# EasyEDA schematic N2 Avionics board.json

## Sheets
1 Sheet_1: TITLE: Avionics N2; REV: 1.0; Date: 2021-09-09; Sheet: 1/1; Drawn By: mike99; Company: Nakuja project
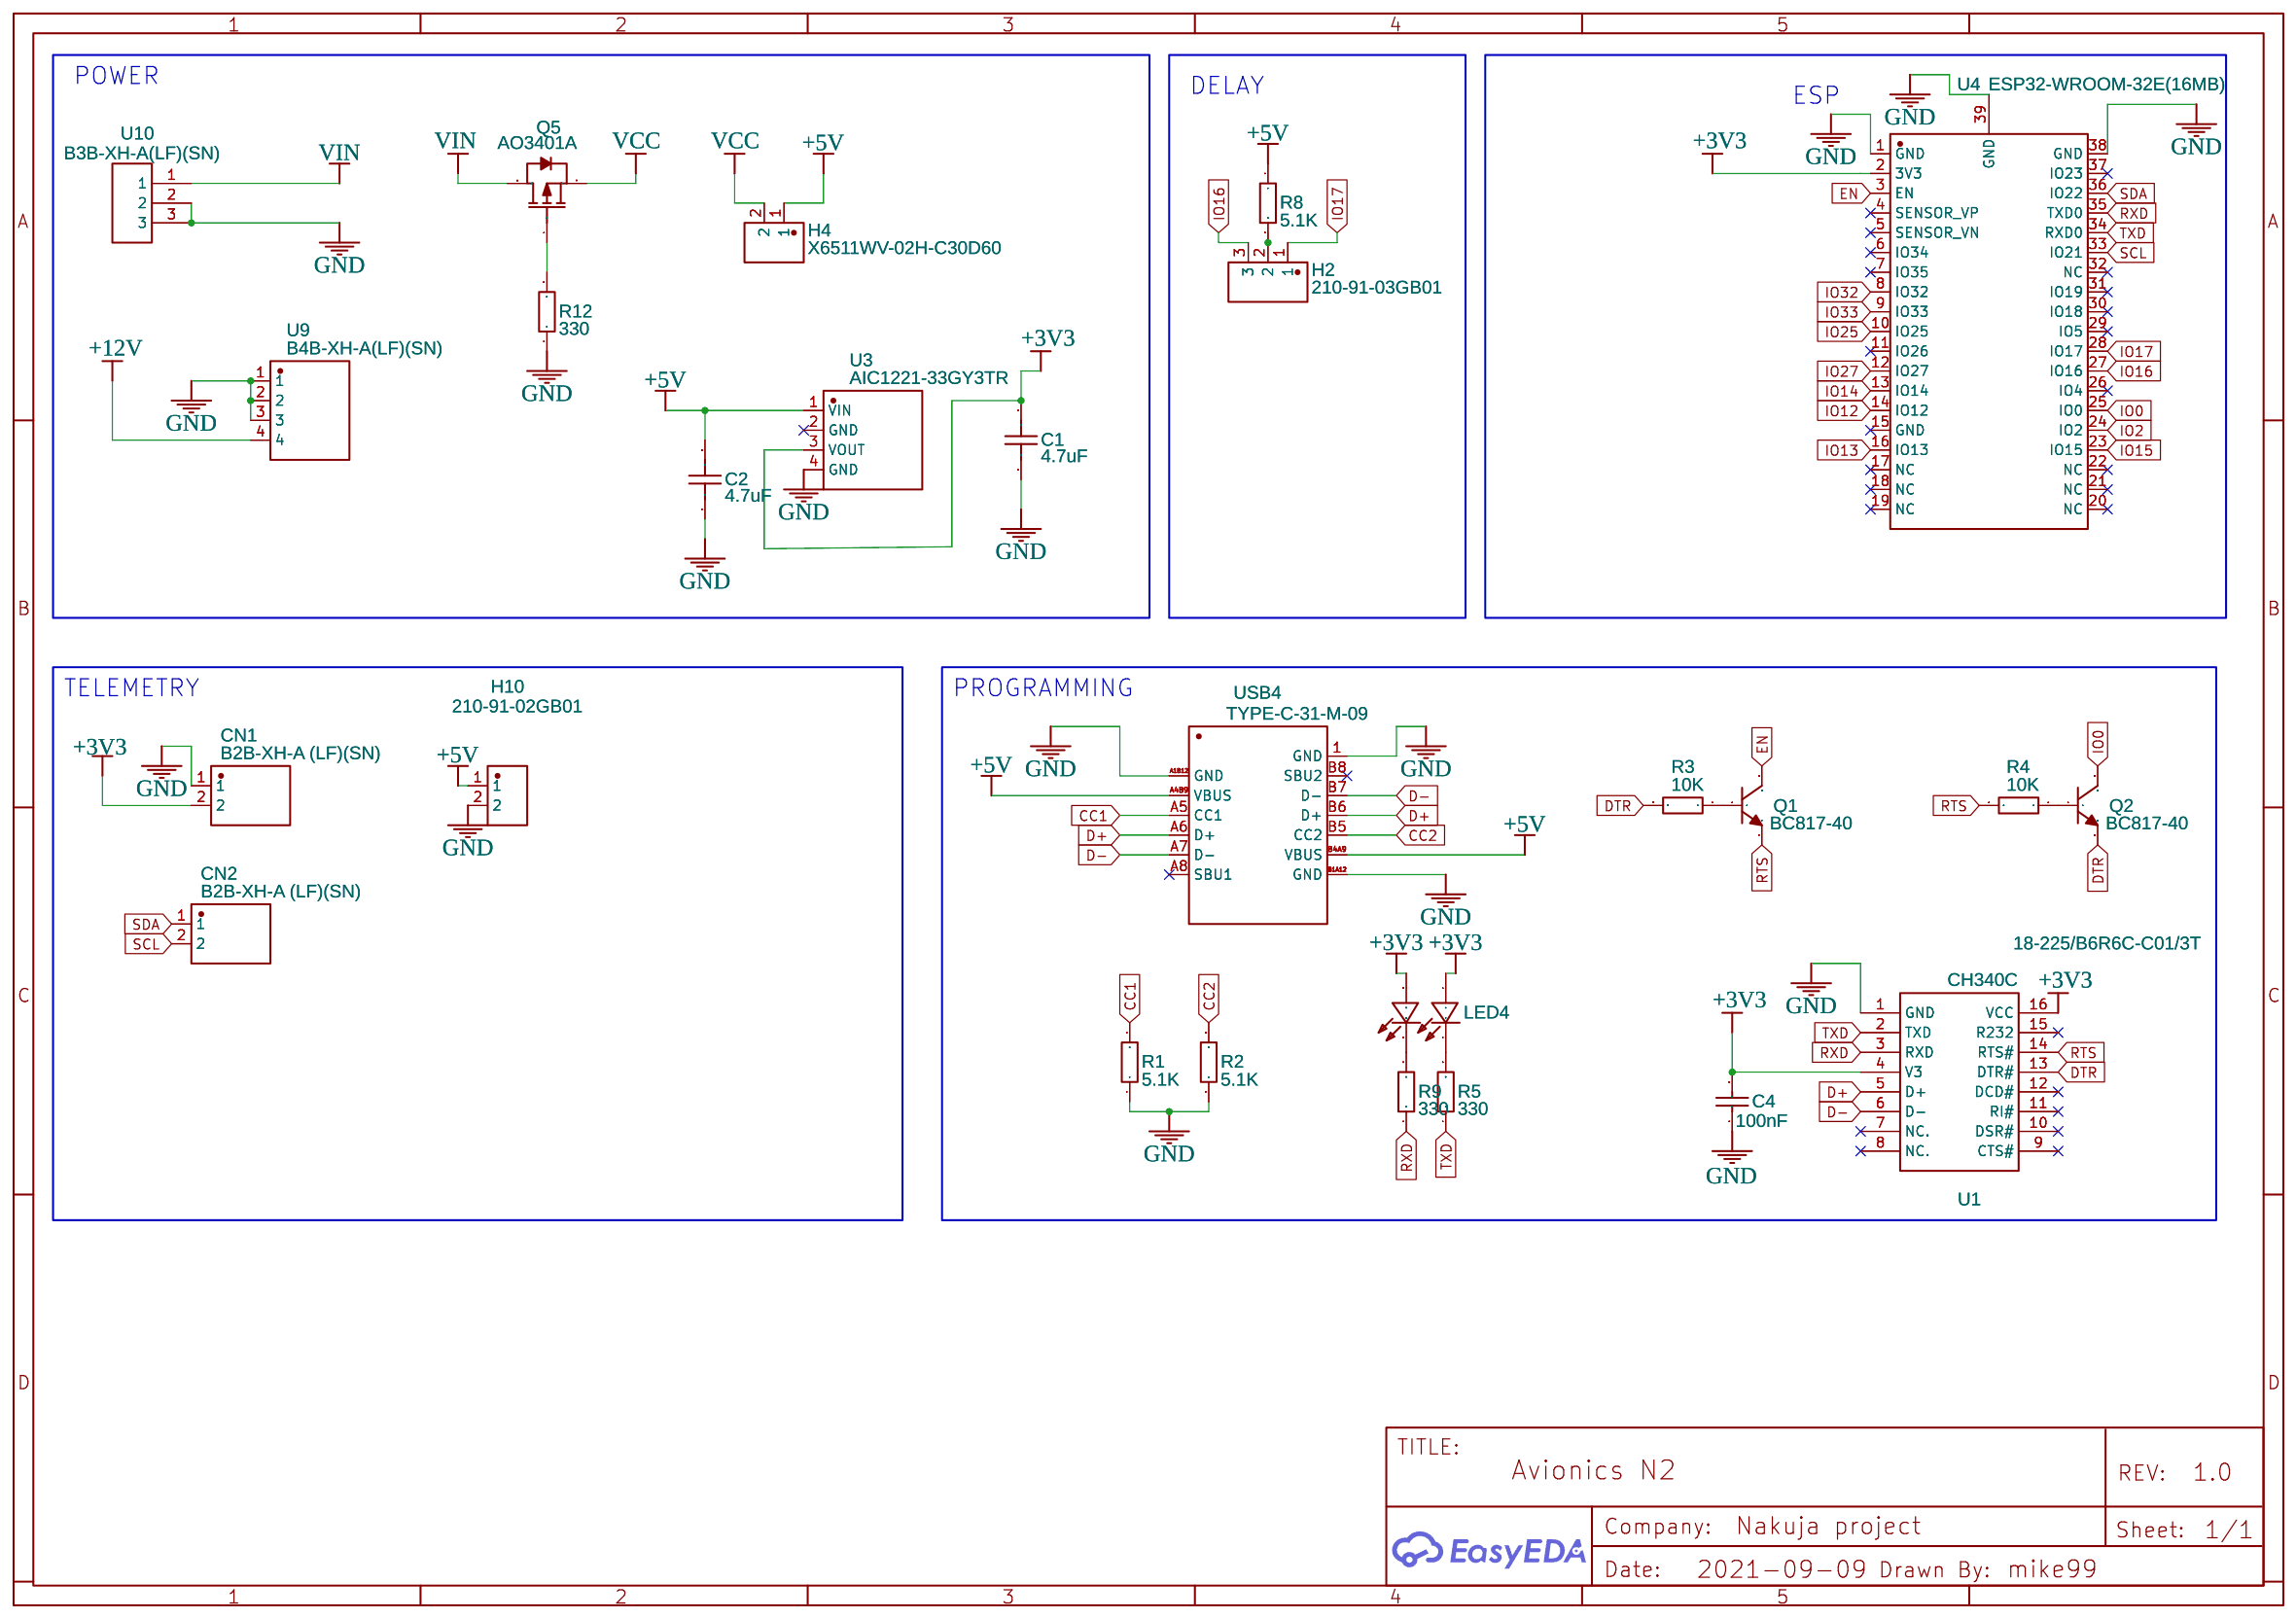
[diagram p0: Sheet_1]
2 Sheet_2: Date: 2021-12-03; Company: Your Company
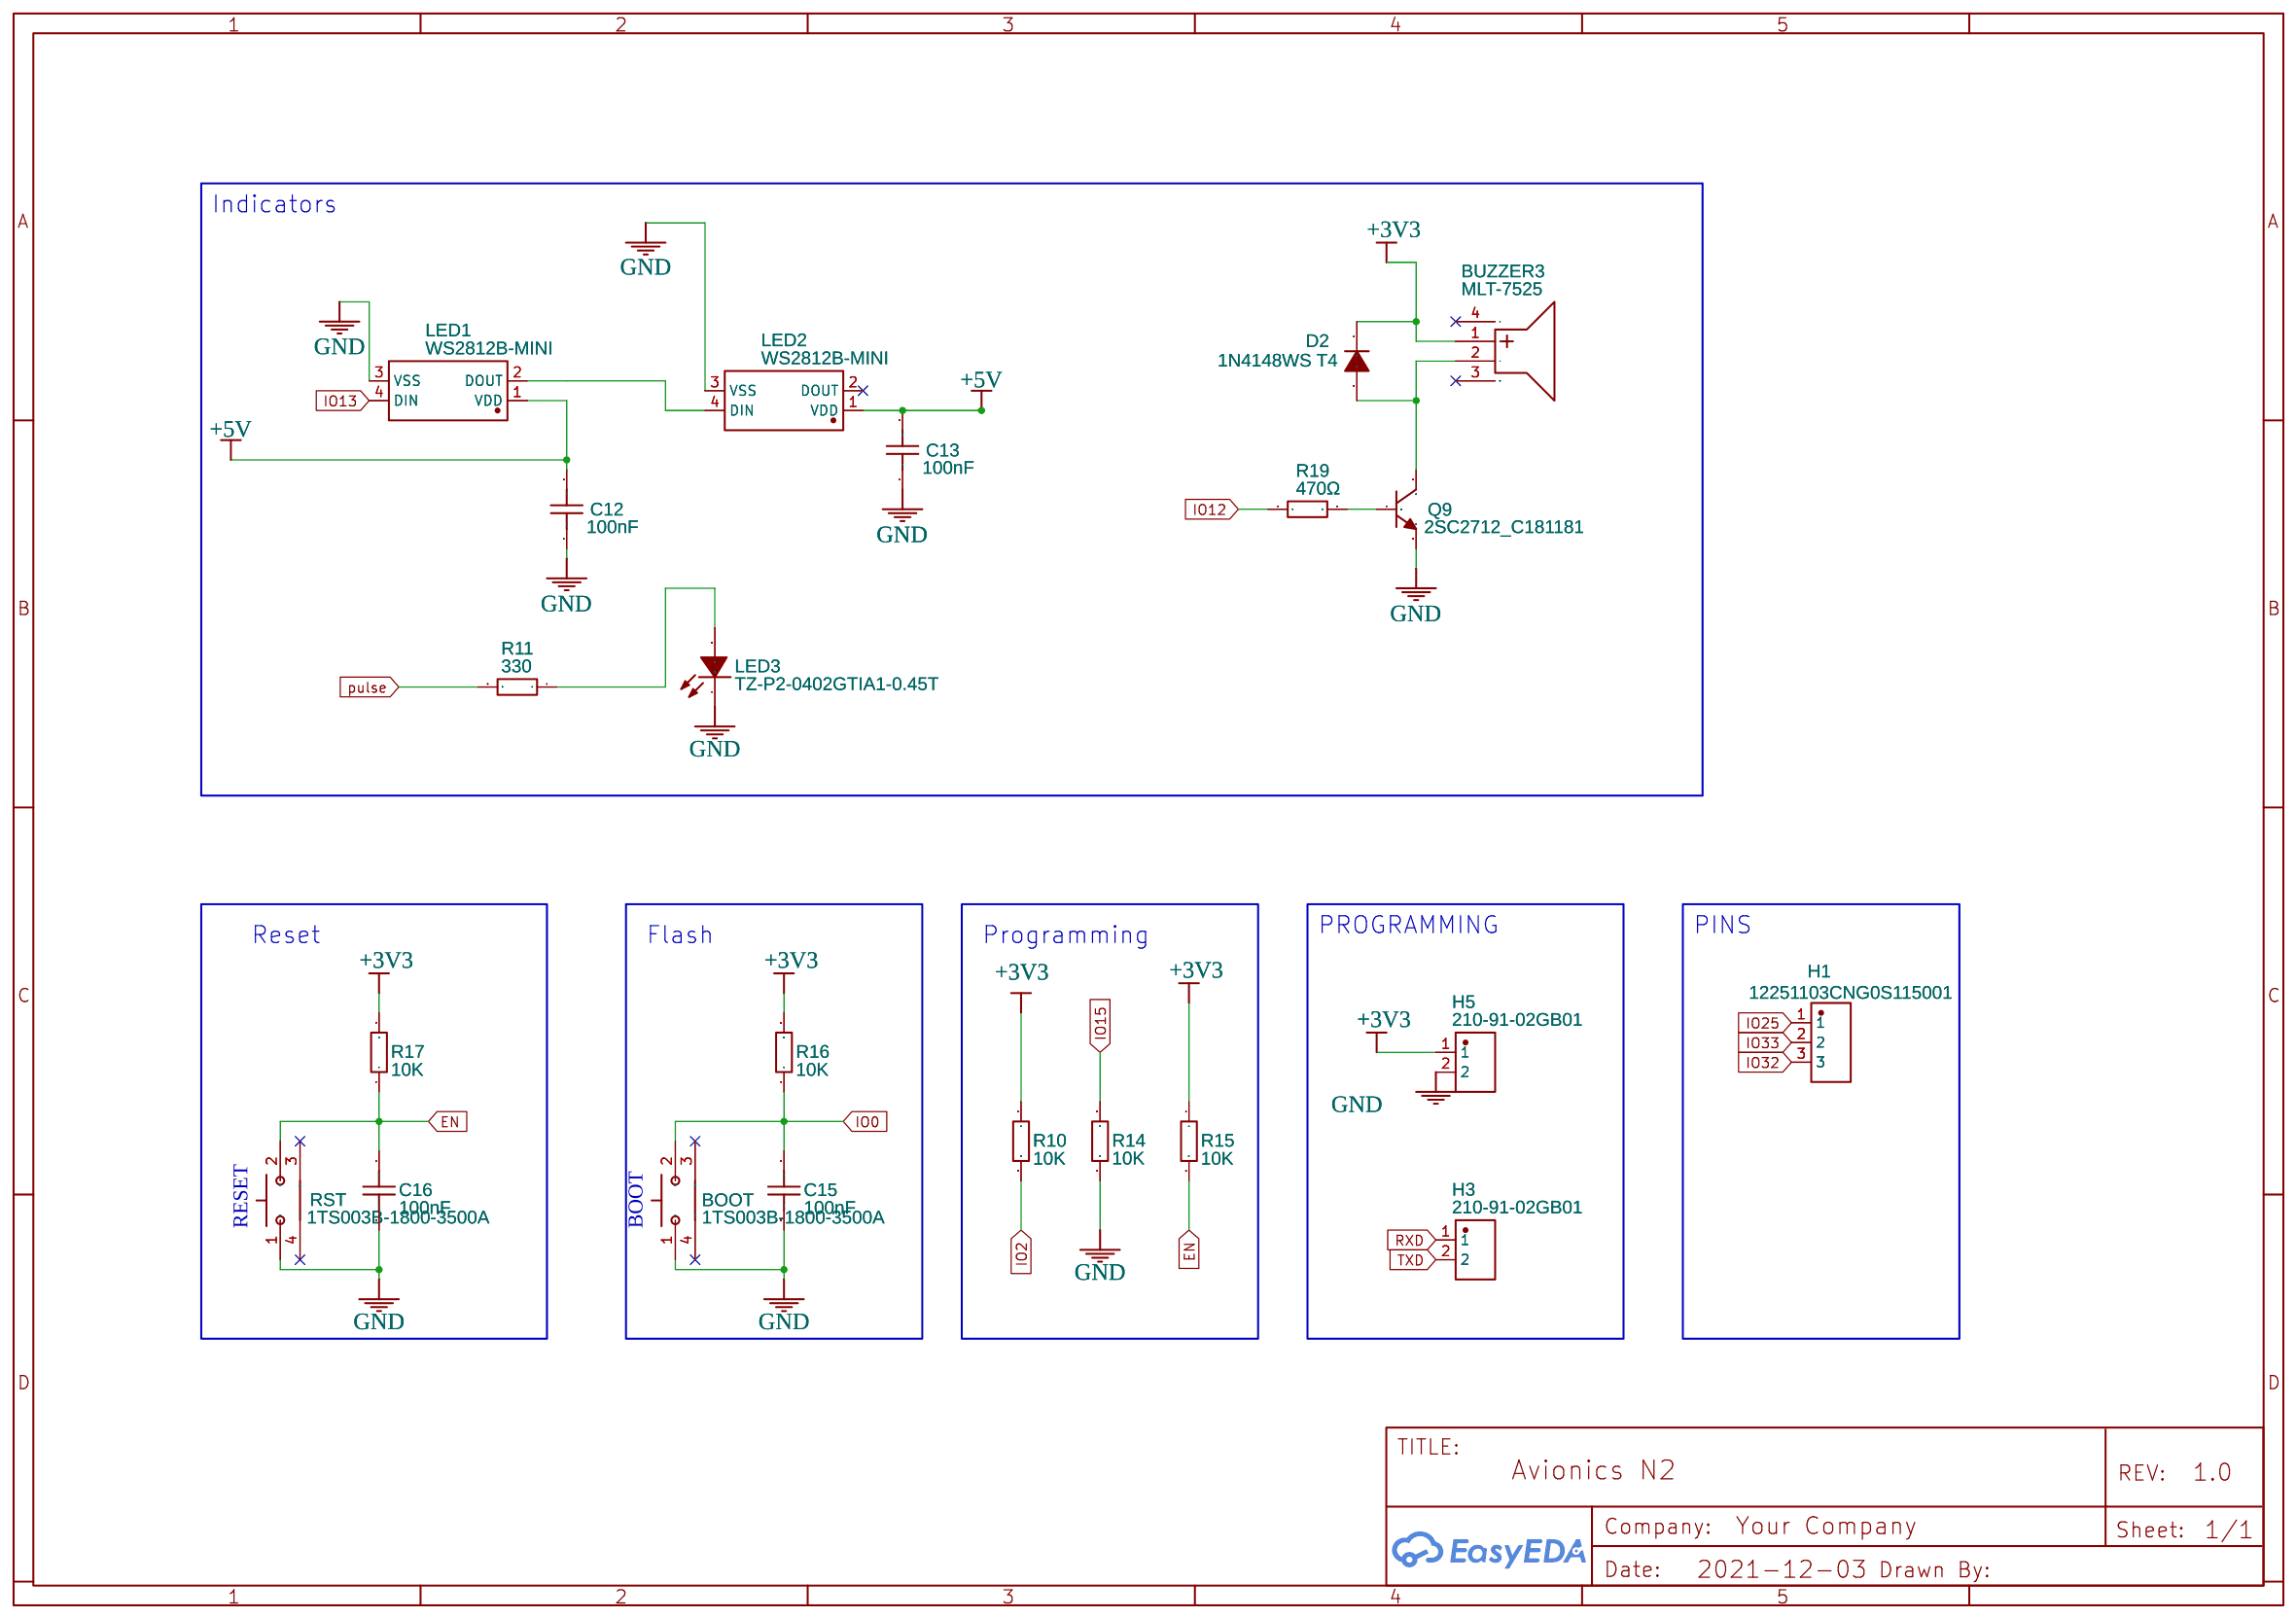
[diagram p1: Sheet_2]
3 Sheet_3: Date: 2022-02-14; Drawn By: Michael Kimani; Company: Your Company
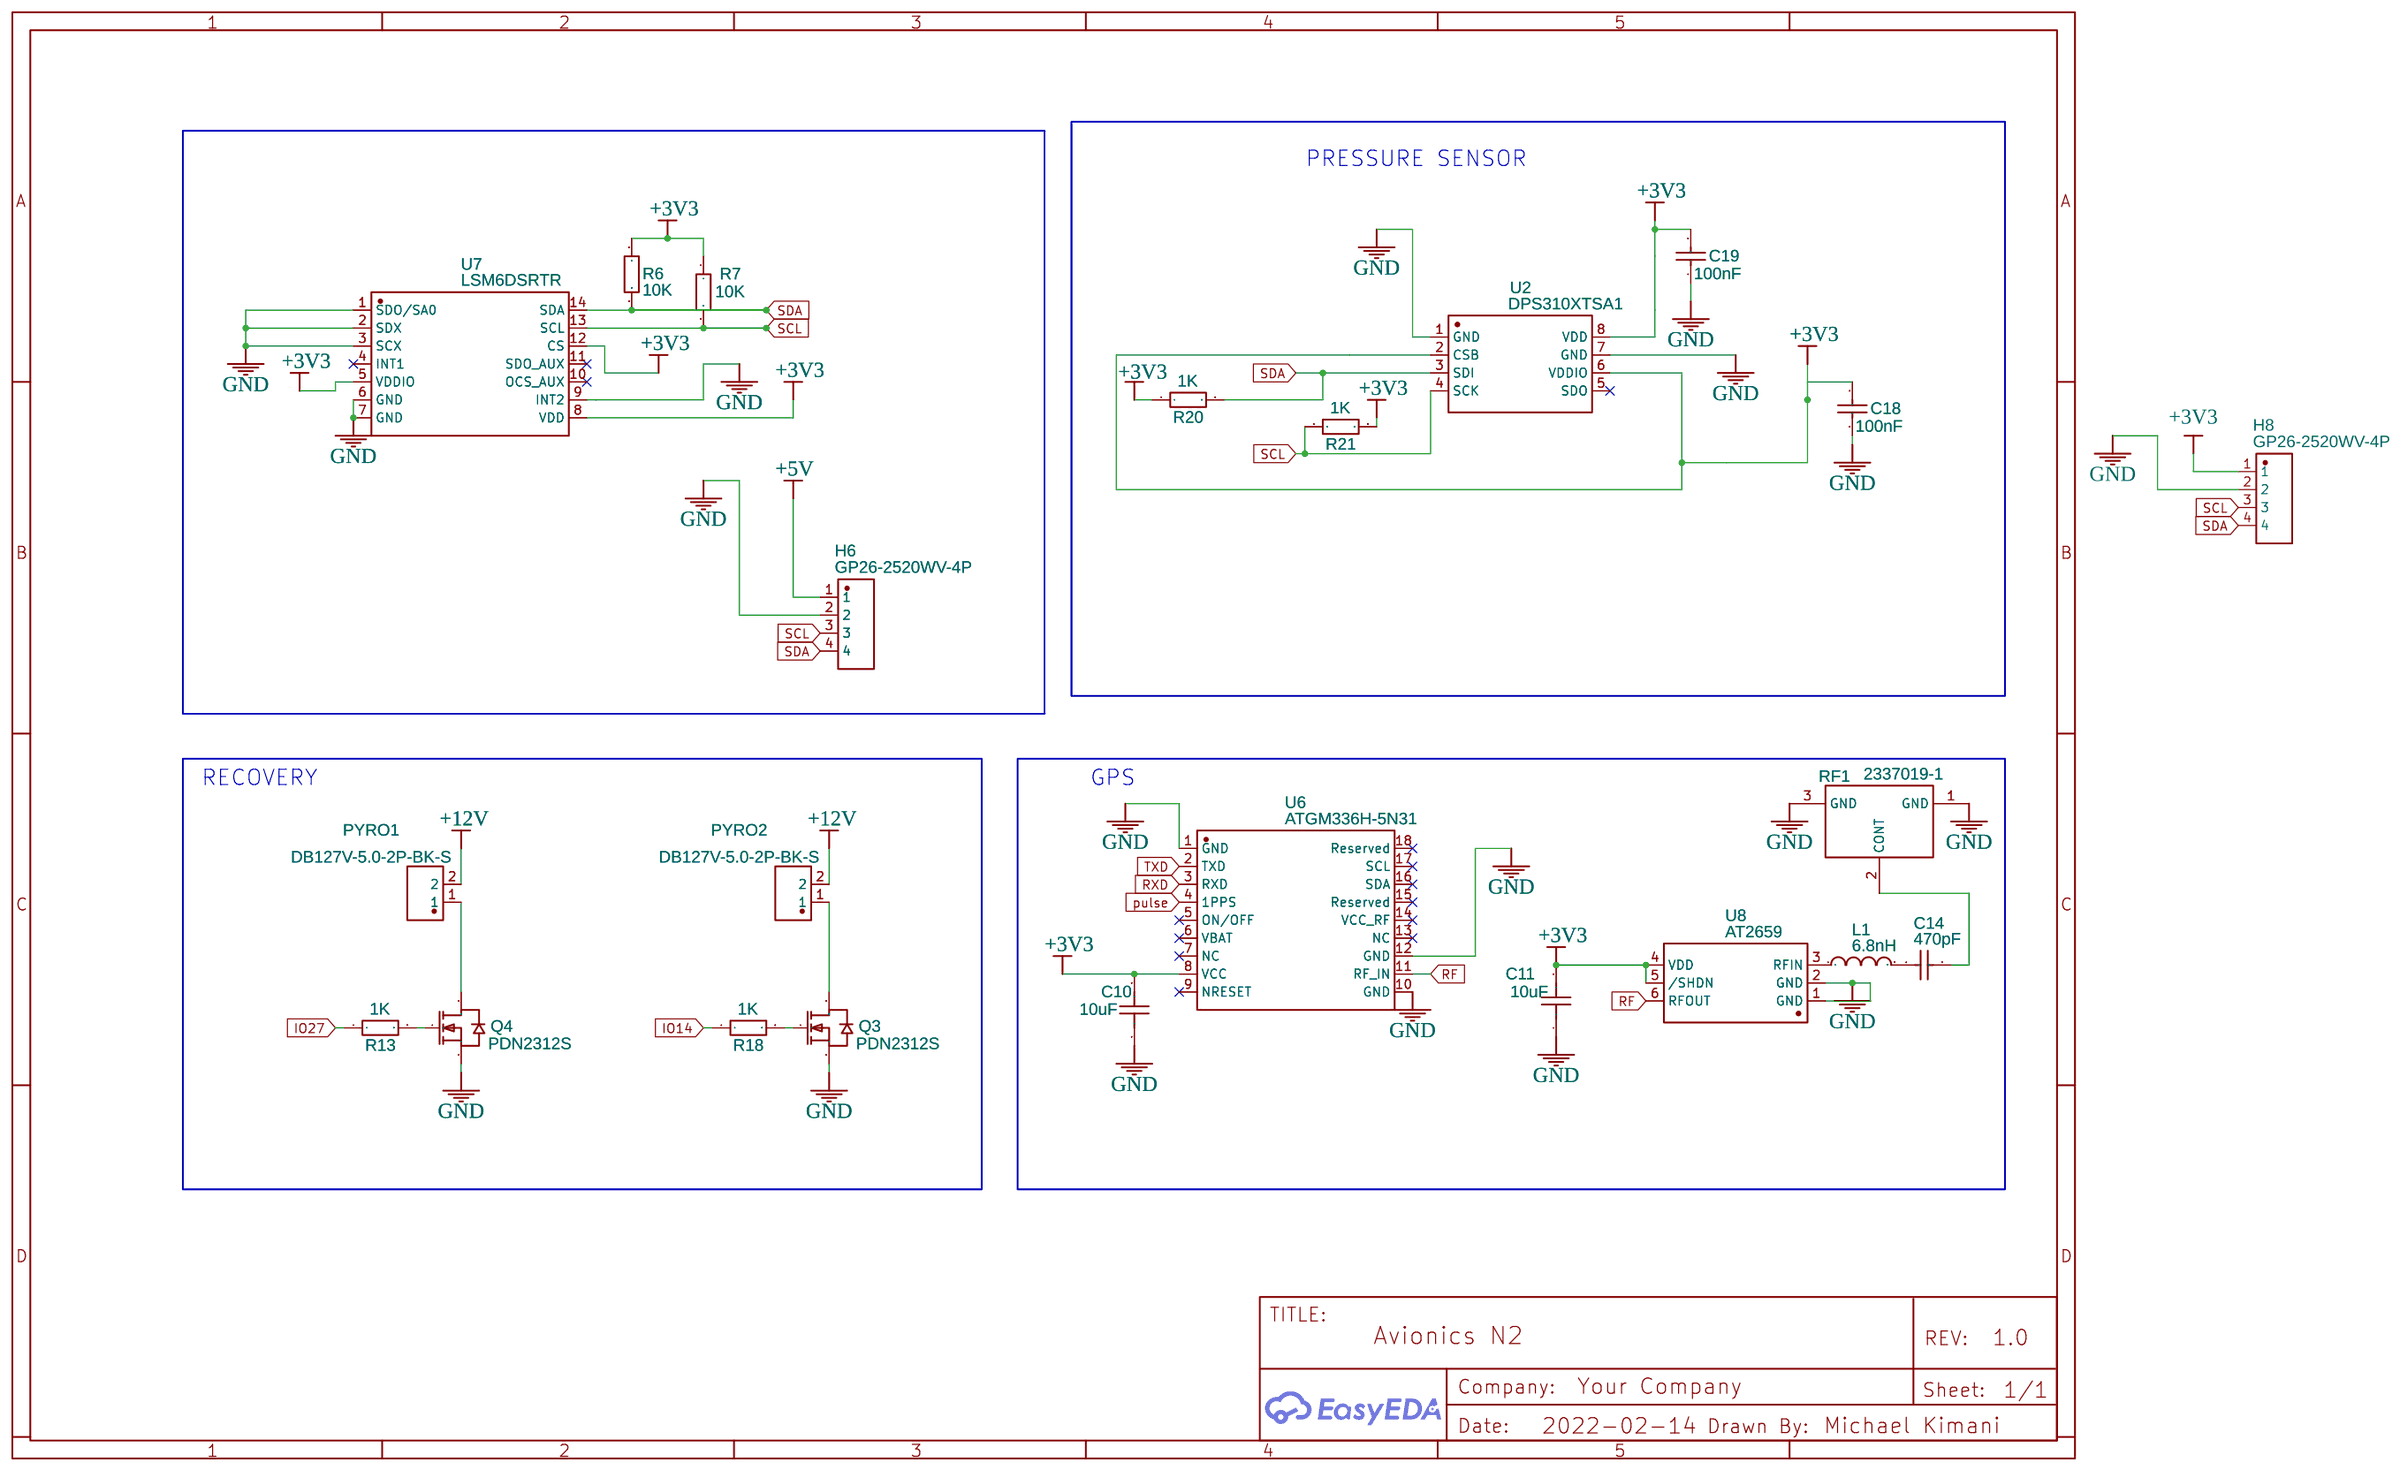
[diagram p2: Sheet_3]

## Parts
sheet Sheet_1
C1  4.7uF  [C0402]
C2  4.7uF  [C0402]
C4  100nF  [C0603]
CN1  B2B-XH-A (LF)(SN)  [CONN-TH_B2B-XH-A-LF-SN]
CN2  B2B-XH-A (LF)(SN)  [CONN-TH_B2B-XH-A-LF-SN]
H2  210-91-03GB01  [HDR-TH_3P-P2.54-V-M]
H4  X6511WV-02H-C30D60  [HDR-TH_2P-P2.54-V-M]
H10  210-91-02GB01  [HDR-TH_2P-P2.54-V-M-1]
LED4  18-225/B6R6C-C01/3T  [LED-SMD_4P-L1.6-W0.8-BR-RD]
Q1  BC817-40  [SOT-23-3_L2.9-W1.6-P1.90-LS2.8-BR]
Q2  BC817-40  [SOT-23-3_L2.9-W1.6-P1.90-LS2.8-BR]
Q5  AO3401A  [SOT-23_L2.9-W1.3-P1.90-LS2.4-BR]
R1  5.1K  [R0402]
R2  5.1K  [R0402]
R3  10K  [R0402]
R4  10K  [R0402]
R5  330  [R0402]
R8  5.1K  [R0402]
R9  330  [R0402]
R12  330  [R0402]
U1  CH340C  [SOP-16_L10.0-W3.9-P1.27-LS6.0-BL]
U3  AIC1221-33GY3TR  [SOT-223_L6.5-W3.5-P2.30-LS7.0-BR]
U4  ESP32-WROOM-32E(16MB)  [WIFI-SMD_ESP32-WROOM-32E]
U9  B4B-XH-A(LF)(SN)  [CONN-TH_B4B-XH-A-LF-SN]
U10  B3B-XH-A(LF)(SN)  [CONN-TH_3P-P2.50_B3B-XH-A-LF-SN]
USB4  TYPE-C-31-M-09  [USB-C-SMD_TYPE-C-31-M-09]
sheet Sheet_2
BOOT  1TS003B-1800-3500A  [SW-SMD_1TS003B-XXXX-3500A-CT]
BUZZER3  MLT-7525  [BUZ-SMD_4P-L7.5-W7.5-P7.59-TL]
C12  100nF  [C0402]
C13  100nF  [C0402]
C15  100nF  [C0402]
C16  100nF  [C0402]
D2  1N4148WS T4  [SOD-323_L1.8-W1.3-LS2.5-RD]
H1  12251103CNG0S115001  [HDR-TH_3P-P2.54-V-M-1]
H3  210-91-02GB01  [HDR-TH_2P-P2.54-V-M-1]
H5  210-91-02GB01  [HDR-TH_2P-P2.54-V-M-1]
LED1  WS2812B-MINI  [LED-SMD_4P-L3.5-W3.5-TL_WS2812B]
LED2  WS2812B-MINI  [LED-SMD_4P-L3.5-W3.5-TL_WS2812B]
LED3  TZ-P2-0402GTIA1-0.45T  [LED0402-RD]
Q9  2SC2712_C181181  [SOT-23-3_L2.9-W1.6-P1.90-LS2.8-BR]
R10  10K  [R0402]
R11  330  [R0402]
R14  10K  [R0402]
R15  10K  [R0402]
R16  10K  [R0402]
R17  10K  [R0402]
R19  470Ω  [R0402]
RST  1TS003B-1800-3500A  [SW-SMD_1TS003B-XXXX-3500A-CT]
sheet Sheet_3
C10  10uF  [C0402]
C11  10uF  [C0402]
C14  470pF  [C0402]
C18  100nF  [C0603]
C19  100nF  [C0603]
H6  GP26-2520WV-4P  [HDR-TH_4P-P2.54-V-F-R1-C4]
H8  GP26-2520WV-4P  [HDR-TH_4P-P2.54-V-F-R1-C4]
L1  6.8nH  [L0402]
PYRO1  DB127V-5.0-2P-BK-S  [CONN-TH_2P-P5.00_DB127V-5.0-2P-BK-S]
PYRO2  DB127V-5.0-2P-BK-S  [CONN-TH_2P-P5.00_DB127V-5.0-2P-BK-S]
Q3  PDN2312S  [SOT-23-3_L2.9-W1.3-P1.90-LS2.4-BR]
Q4  PDN2312S  [SOT-23-3_L2.9-W1.3-P1.90-LS2.4-BR]
R6  10K  [R0402]
R7  10K  [R0402]
R13  1K  [R0402]
R18  1K  [R0402]
R20  1K  [R0402]
R21  1K  [R0402]
RF1  2337019-1  [ANT-SMD_2337019-1]
U2  DPS310XTSA1  [LGA-8_DPS310XTSA1]
U6  ATGM336H-5N31  [GPSM-SMD_ATGM336H-TR]
U7  LSM6DSRTR  [LGA-14_L3.0-W2.5-P0.50-BR]
U8  AT2659  [DFN-6_L1.6-W1.0-P0.55-BL]

## Library data of the parts
C1 C2 = CL05A475MO5NUNC: Supplier: LCSC; Supplier Part: C318563; Manufacturer: Samsung Electro-Mechanics; Contributor: LCSC; JLCPCB Part Class: Extended Part
C4 C18 C19 = 0603B104K250: Supplier: LCSC; Manufacturer: WTC; Supplier Part: C83054; JLCPCB Part Class: Extended Part
CN1 CN2 = B2B-XH-A (LF)(SN): Supplier: LCSC; Supplier Part: C158012; Manufacturer: JST Sales America; Contributor: LCSC; JLCPCB Part Class: Extended Part
H2 = 210-91-03GB01: Supplier: LCSC; Supplier Part: C390679; Manufacturer: PINREX; Contributor: LCSC; JLCPCB Part Class: Extended Part
H4 = X6511WV-02H-C30D60: Supplier: LCSC; Supplier Part: C706874; Manufacturer: XKB Connectivity; Contributor: LCSC; JLCPCB Part Class: Extended Part
H3 H5 H10 = 210-91-02GB01: Supplier: LCSC; Supplier Part: C390678; Manufacturer: PINREX; Contributor: LCSC; JLCPCB Part Class: Extended Part
LED4 = 18-225/B6R6C-C01/3T: Supplier: LCSC; Supplier Part: C282127; Manufacturer: Everlight Elec; Contributor: LCSC; JLCPCB Part Class: Extended Part
Q1 Q2 = BC817-40: Supplier: LCSC; Manufacturer: Hottech; Contributor: LCSC; Supplier Part: C181151; JLCPCB Part Class: Extended Part
Q5 = AO3401A: Supplier: LCSC; Manufacturer: AOS; Supplier Part: C15127; JLCPCB Part Class: Basic Part
R1 R2 R8 = 0402WGF5101TCE: Supplier: LCSC; Manufacturer: UniOhm; Supplier Part: C25905; JLCPCB Part Class: Basic Part
R3 R4 R6 R7 R10 R14-R17 = RTT02103JTH: Supplier: LCSC; Manufacturer: RALEC; Supplier Part: C102759; JLCPCB Part Class: Extended Part
R5 R9 R11 R12 = 0402WGJ0331TCE: Supplier: LCSC; Manufacturer: UniOhm; Supplier Part: C12246; JLCPCB Part Class: Extended Part
U1 = CH340C: Supplier: LCSC; Manufacturer: WCH; Supplier Part: C84681; JLCPCB Part Class: Extended Part
U3 = AIC1221-33GY3TR: Supplier: LCSC; Supplier Part: C211622; Manufacturer: Analog Integrations; Contributor: LCSC; JLCPCB Part Class: Extended Part
U4 = ESP32-WROOM-32E(16MB): Supplier: LCSC; Supplier Part: C701343; Manufacturer: Espressif Systems; Contributor: LCSC; JLCPCB Part Class: Extended Part
U9 = B4B-XH-A(LF)(SN): Supplier: LCSC; Supplier Part: C144395; Manufacturer: JST Sales America; Contributor: LCSC; JLCPCB Part Class: Extended Part
U10 = B3B-XH-A(LF)(SN): Supplier: LCSC; Supplier Part: C144394; Manufacturer: JST Sales America; Contributor: LCSC; JLCPCB Part Class: Extended Part
USB4 = TYPE-C-31-M-09: Supplier: LCSC; Supplier Part: C2689967; Manufacturer: 韩国韩荣; Contributor: LCSC; JLCPCB Part Class: Extended Part
BOOT RST = 1TS003B-1800-3500A: Supplier: LCSC; Supplier Part: C255809; Manufacturer: HYP; Contributor: LCSC; JLCPCB Part Class: Extended Part; Package Display: No
BUZZER3 = MLT-7525: Supplier: LCSC; Supplier Part: C95299; Manufacturer: Jiangsu Huaneng Elec; Contributor: LCSC; JLCPCB Part Class: Extended Part
C12 C13 C15 C16 = CL05B104KB54PNC: Supplier: LCSC; Supplier Part: C307331; Manufacturer: Samsung Electro-Mechanics; Contributor: LCSC; JLCPCB Part Class: Extended Part
D2 = 1N4148WS T4: Supplier: LCSC; Manufacturer: CJ; Supplier Part: C2128; JLCPCB Part Class: Basic Part
H1 = 12251103CNG0S115001: Supplier: LCSC; Supplier Part: C429954; Manufacturer: JILN; Contributor: LCSC; JLCPCB Part Class: Extended Part
LED1 LED2 = WS2812B-MINI: Supplier: LCSC; Supplier Part: C527089; Manufacturer: Worldsemi; Manufacturer Part: WS2812B-Mini; Contributor: LCSC; JLCPCB Part Class: Extended Part
LED3 = TZ-P2-0402GTIA1-0.45T: Supplier: LCSC; Supplier Part: C688877; Manufacturer: TUOZHAN; Contributor: LCSC; JLCPCB Part Class: Extended Part
Q9 = 2SC2712_C181181: Supplier: LCSC; Manufacturer: Hottech; Manufacturer Part: 2SC2712; Contributor: LCSC; Supplier Part: C181181; JLCPCB Part Class: Extended Part
R19 = 0402WGF4700TCE: Supplier: LCSC; Manufacturer: UniOhm; Supplier Part: C25117; Resistance (Ohms): 470; JLCPCB Part Class: Basic Part
C10 C11 = CL05A106MQ8NUB8: Supplier: LCSC; Supplier Part: C307416; Manufacturer: Samsung Electro-Mechanics; Contributor: LCSC; JLCPCB Part Class: Extended Part
C14 = 0402B471K500NT: Supplier: LCSC; Manufacturer: FH; Supplier Part: C1537; JLCPCB Part Class: Basic Part
H6 H8 = GP26-2520WV-4P: Supplier: LCSC; Supplier Part: C2681739; Manufacturer: GEPU(歌普); Contributor: LCSC; JLCPCB Part Class: Extended Part
L1 = SDCL1005C6N8JTDF: Supplier: LCSC; Manufacturer: Sunlord; Supplier Part: C32041; JLCPCB Part Class: Basic Part
PYRO1 PYRO2 = DB127V-5.0-2P-BK-S: Supplier: LCSC; Supplier Part: C430623; Manufacturer: DIBO; Contributor: LCSC; JLCPCB Part Class: Extended Part
Q3 Q4 = PDN2312S: Supplier: LCSC; Supplier Part: C441842; Manufacturer: Potens; Contributor: LCSC; JLCPCB Part Class: Extended Part
R13 R18 R20 R21 = 0402WGF1001TCE: Supplier: LCSC; Manufacturer: UniOhm; Supplier Part: C11702; JLCPCB Part Class: Basic Part
RF1 = 2337019-1: Supplier: LCSC; Supplier Part: C434807; Manufacturer: TE Connectivity; Contributor: LCSC; JLCPCB Part Class: Extended Part
U2 = DPS310XTSA1: Supplier: LCSC; Manufacturer: Infineon; Supplier Part: C130156; JLCPCB Part Class: Extended Part
U6 = ATGM336H-5N31: Supplier: LCSC; Manufacturer: ZHONGKEWEI; Supplier Part: C90770; JLCPCB Part Class: Extended Part
U7 = LSM6DSRTR: Supplier: LCSC; Supplier Part: C784817; Manufacturer: ST(意法半导体); Contributor: LCSC; JLCPCB Part Class: Extended Part
U8 = AT2659: Supplier: LCSC; Manufacturer: ZHONGKEWEI; Supplier Part: C92450; Contributor: 立创EDA官方封装库; JLCPCB Part Class: Extended Part

## Nets
+3V3: BUZZER3.1(+) C1.2 C4.2 C10.2 C11.2 C18.2 C19.2 CN1.2 D2.1(K) H5.1 H8.1 LED4.1 LED4.2 R6.1 R7.1 R10.1 R15.1 R16.2 R17.2 R20.1 R21.2 U1.4(V3) U1.16(VCC) U2.2(CSB) U2.6(VDDIO) U2.8(VDD) U3.3(VOUT) U4.2(3V3) U6.8(VCC) U7.5(VDDIO) U7.8(VDD) U7.12(CS) U8.4(VDD) U8.5(/SHDN)
+5V: C2.2 C12.2 C13.2 H4.1 H6.1 H10.1 LED1.1(VDD) LED2.1(VDD) R8.1 U3.1(VIN) USB4.A4B9(VBUS) USB4.B4A9(VBUS)
+12V: PYRO1.2 PYRO2.2 U9.4
GND: BOOT.1 C1.1 C2.1 C4.1 C10.1 C11.1 C12.1 C13.1 C15.2 C16.2 C18.1 C19.1 CN1.1 H5.2 H6.2 H8.2 H10.2 LED1.3(VSS) LED2.3(VSS) LED3.1(C) Q3.2(S) Q4.2(S) Q9.2(E) R1.1 R2.1 R12.1 R14.1 RF1.1(GND) RF1.3(GND) RST.1 U1.1(GND) U2.1(GND) U2.7(GND) U3.4(GND) U4.1(GND) U4.38(GND) U4.39(GND) U6.1(GND) U6.10(GND) U6.12(GND) U7.1(SDO/SA0) U7.2(SDX) U7.3(SCX) U7.6(GND) U7.7(GND) U7.9(INT2) U8.1(GND) U8.2(GND) U9.1 U9.2 U9.3 U10.2 U10.3 USB4.1(GND) USB4.A1B12(GND) USB4.B1A12(GND)
VCC: H4.2 Q5.2(S)
VIN: Q5.3(D) U10.1
CC1: R1.2 USB4.A5(CC1)
CC2: R2.2 USB4.B5(CC2)
D+: U1.5(D+) USB4.A6(D+) USB4.B6(D+)
D-: U1.6(D-) USB4.A7(D-) USB4.B7(D-)
DTR: Q2.2 R3.2 U1.13(DTR#)
EN: C16.1 Q1.3 R15.2 R17.1 RST.2 U4.3(EN)
IO0: BOOT.2 C15.1 Q2.3 R16.1 U4.25(IO0)
IO2: R10.2 U4.24(IO2)
IO12: R19.1 U4.14(IO12)
IO13: LED1.4(DIN) U4.16(IO13)
IO14: R18.1 U4.13(IO14)
IO15: R14.2 U4.23(IO15)
IO16: H2.3 U4.27(IO16)
IO17: H2.1 U4.28(IO17)
IO25: H1.1 U4.10(IO25)
IO27: R13.1 U4.12(IO27)
IO32: H1.3 U4.8(IO32)
IO33: H1.2 U4.9(IO33)
pulse: R11.2 U6.4(1PPS)
RF: U6.11(RF_IN) U8.6(RFOUT)
RTS: Q1.2 R4.2 U1.14(RTS#)
RXD: H3.1 R9.1 U1.3(RXD) U4.35(TXD0) U6.3(RXD)
SCL: CN2.2 H6.3 H8.3 R7.2 R21.1 U2.4(SCK) U4.33(IO21) U7.13(SCL)
SDA: CN2.1 H6.4 H8.4 R6.2 R20.2 U2.3(SDI) U4.36(IO22) U7.14(SDA)
TXD: H3.2 R5.1 U1.2(TXD) U4.34(RXD0) U6.2(TXD)
Net-(BUZZER3-2): BUZZER3.2(-) D2.2(A) Q9.3(C)
Net-(C14-1): C14.1 L1.2
Net-(C14-2): C14.2 RF1.2(CONT)
Net-(H2-2): H2.2 R8.2
Net-(L1-1): L1.1 U8.3(RFIN)
Net-(LED1-2): LED1.2(DOUT) LED2.4(DIN)
Net-(LED3-2): LED3.2(A) R11.1
Net-(LED4-3): LED4.3 R9.2
Net-(LED4-4): LED4.4 R5.2
Net-(PYRO1-1): PYRO1.1 Q4.3(D)
Net-(PYRO2-1): PYRO2.1 Q3.3(D)
Net-(Q1-1): Q1.1 R3.1
Net-(Q2-1): Q2.1 R4.1
Net-(Q3-1): Q3.1(G) R18.2
Net-(Q4-1): Q4.1(G) R13.2
Net-(Q5-1): Q5.1(G) R12.2
Net-(Q9-1): Q9.1(B) R19.2

Not connected (* = marked no-connect by the designer): BOOT 3* 4*; BUZZER3 3* 4*; LED2 2(DOUT)*; RST 3* 4*; U1 7(NC.)* 8(NC.)* 9(CTS#)* 10(DSR#)* 11(RI#)* 12(DCD#)* 15(R232)*; U2 5(SDO)*; U3 2(GND)*; U4 4(SENSOR_VP)* 5(SENSOR_VN)* 6(IO34)* 7(IO35)* 11(IO26)* 15(GND)* 17(NC)* 18(NC)* 19(NC)* 20(NC)* 21(NC)* 22(NC)* 26(IO4)* 29(IO5)* 30(IO18)* 31(IO19)* 32(NC)* 37(IO23)*; U6 5(ON/OFF)* 6(VBAT)* 7(NC)* 9(NRESET)* 13(NC)* 14(VCC_RF)* 15(Reserved)* 16(SDA)* 17(SCL)* 18(Reserved)*; U7 4(INT1)* 10(OCS_AUX)* 11(SDO_AUX)*; USB4 A8(SBU1)* B8(SBU2)*

## Notes on the sheets
sheet 1
- POWER
- DELAY
- ESP
- TELEMETRY
- PROGRAMMING
sheet 2
- Indicators
- Reset
- Flash
- Programming
- PROGRAMMING
- PINS
- RESET
- BOOT
sheet 3
- PRESSURE SENSOR
- RECOVERY
- GPS
